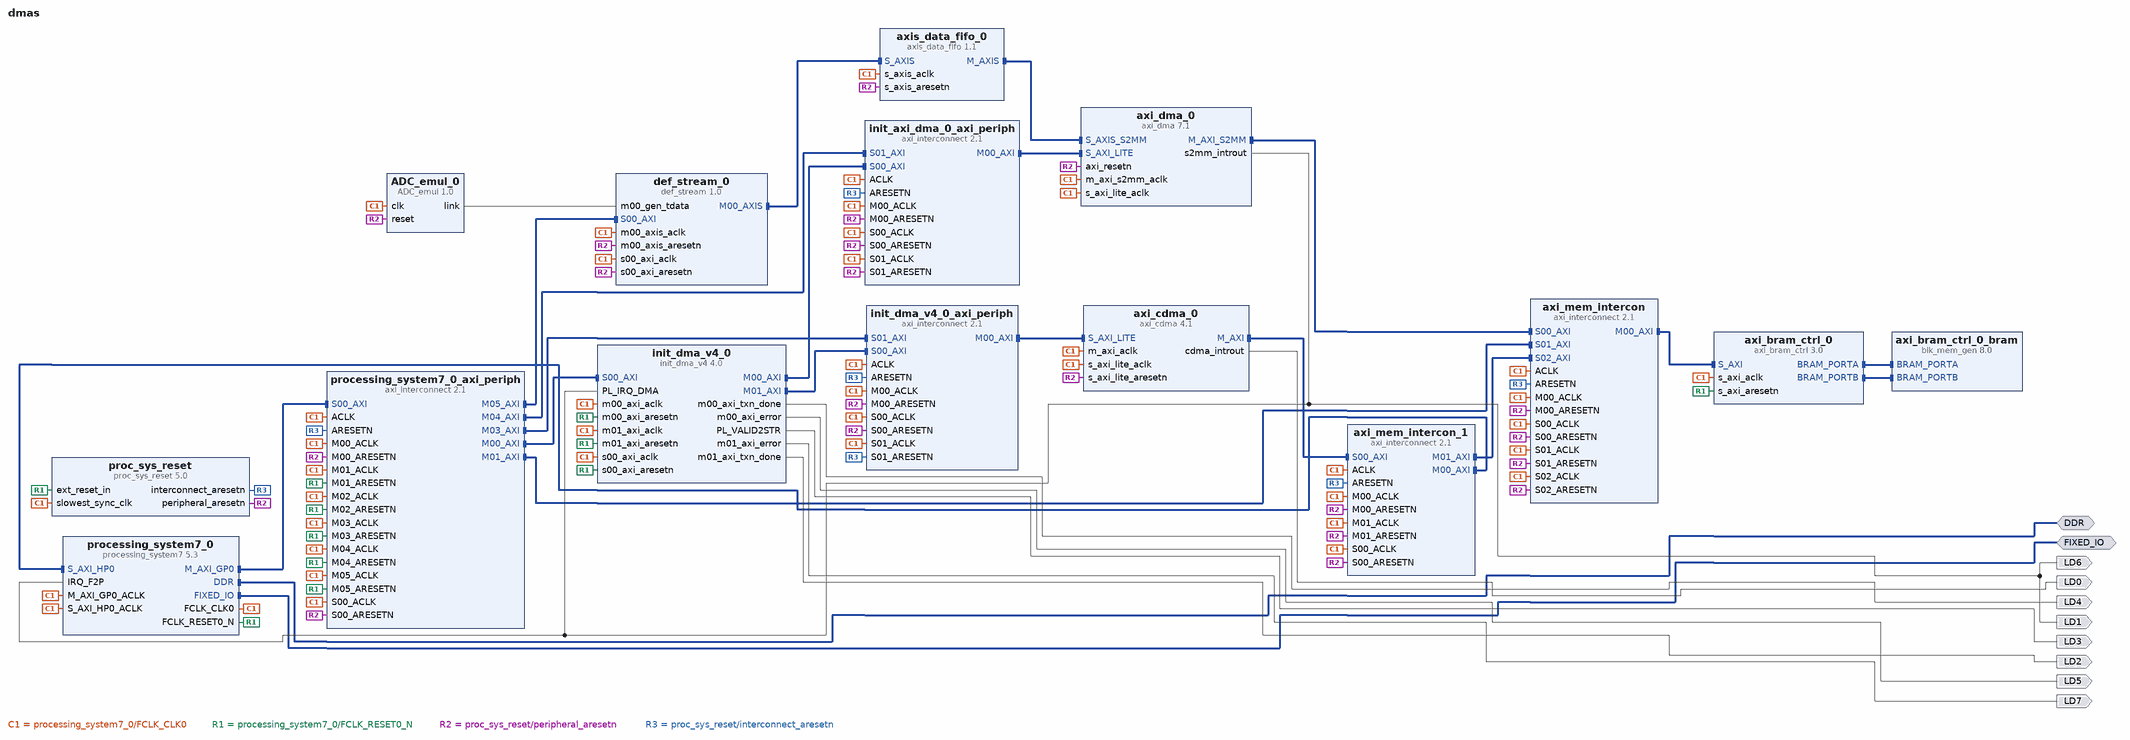
[diagram p0: block diagram of the top level]
# Vivado block design dmas, Vivado 2013.3
create_bd_design dmas

create_bd_intf_port -mode Master -vlnv xilinx.com:interface:ddrx_rtl:1.0 DDR
create_bd_intf_port -mode Master -vlnv xilinx.com:display_processing_system7:fixedio_rtl:1.0 FIXED_IO
create_bd_port -dir O LD4
create_bd_port -dir O LD5
create_bd_port -dir O LD6
create_bd_port -dir O LD1
create_bd_port -dir O LD3
create_bd_port -dir O LD0
create_bd_port -dir O LD7
create_bd_port -dir O LD2

create_bd_cell -type ip -vlnv xilinx.com:ip:processing_system7:5.3 processing_system7_0
set_property -dict [list \
  CONFIG.PCW_USE_S_AXI_HP0 1 \
  CONFIG.PCW_USE_FABRIC_INTERRUPT 1 \
  CONFIG.PCW_IRQ_F2P_INTR 1 \
  CONFIG.PCW_QSPI_GRP_FBCLK_ENABLE 1 \
  CONFIG.preset {ZedBoard*} \
] [get_bd_cells processing_system7_0]
create_bd_cell -type ip -vlnv xilinx.com:ip:axi_dma:7.1 axi_dma_0
set_property -dict [list \
  CONFIG.c_include_sg 0 \
  CONFIG.c_sg_length_width 23 \
  CONFIG.c_micro_dma 0 \
  CONFIG.c_include_mm2s 0 \
  CONFIG.c_s2mm_burst_size 16 \
] [get_bd_cells axi_dma_0]
create_bd_cell -type ip -vlnv xilinx.com:ip:axi_interconnect:2.1 axi_mem_intercon
set_property -dict {CONFIG.NUM_SI 3 CONFIG.NUM_MI 1} [get_bd_cells axi_mem_intercon]
create_bd_cell -type ip -vlnv xilinx.com:ip:proc_sys_reset:5.0 proc_sys_reset
create_bd_cell -type ip -vlnv xilinx.com:ip:axi_interconnect:2.1 processing_system7_0_axi_periph
set_property -dict {CONFIG.NUM_SI 1 CONFIG.NUM_MI 6} [get_bd_cells processing_system7_0_axi_periph]
create_bd_cell -type ip -vlnv xilinx.com:ip:axi_interconnect:2.1 init_axi_dma_0_axi_periph
set_property -dict {CONFIG.NUM_SI 2 CONFIG.NUM_MI 1} [get_bd_cells init_axi_dma_0_axi_periph]
create_bd_cell -type ip -vlnv xilinx.com:ip:axi_bram_ctrl:3.0 axi_bram_ctrl_0
create_bd_cell -type ip -vlnv xilinx.com:ip:blk_mem_gen:8.0 axi_bram_ctrl_0_bram
set_property -dict {CONFIG.Memory_Type True_Dual_Port_RAM} [get_bd_cells axi_bram_ctrl_0_bram]
create_bd_cell -type ip -vlnv xilinx.com:ip:axi_cdma:4.1 axi_cdma_0
set_property -dict {CONFIG.C_INCLUDE_SG 0} [get_bd_cells axi_cdma_0]
create_bd_cell -type ip -vlnv xilinx.com:ip:axi_interconnect:2.1 axi_mem_intercon_1
set_property -dict {CONFIG.NUM_MI 2} [get_bd_cells axi_mem_intercon_1]
create_bd_cell -type ip -vlnv xilinx.com:ip:axi_interconnect:2.1 init_dma_v4_0_axi_periph
set_property -dict {CONFIG.NUM_SI 2 CONFIG.NUM_MI 1} [get_bd_cells init_dma_v4_0_axi_periph]
create_bd_cell -type ip -vlnv xilinx.com:user:init_dma_v4:4.0 init_dma_v4_0
set_property -dict [list \
  CONFIG.C_M00_AXI_START_DATA_VALUE 0x4 \
  CONFIG.C_M00_AXI_TARGET_SLAVE_BASE_ADDR 0x41E00030 \
  CONFIG.C_M00_AXI_TRANSACTIONS_NUM 19 \
  CONFIG.C_M01_AXI_START_DATA_VALUE 0x1000 \
  CONFIG.C_M01_AXI_TARGET_SLAVE_BASE_ADDR 0x44A00000 \
  CONFIG.C_M01_AXI_TRANSACTIONS_NUM 11 \
] [get_bd_cells init_dma_v4_0]
create_bd_cell -type ip -vlnv xilinx.com:ip:axis_data_fifo:1.1 axis_data_fifo_0
set_property -dict {CONFIG.FIFO_DEPTH 32768} [get_bd_cells axis_data_fifo_0]
create_bd_cell -type ip -vlnv omega.local:user:ADC_emul:1.0 ADC_emul_0
set_property -dict {CONFIG.WIDTH 16} [get_bd_cells ADC_emul_0]
create_bd_cell -type ip -vlnv xilinx.com:user:def_stream:1.0 def_stream_0

# ---- connections ----

connect_bd_intf_net [get_bd_intf_pins processing_system7_0/M_AXI_GP0] [get_bd_intf_pins processing_system7_0_axi_periph/S00_AXI]
connect_bd_intf_net [get_bd_intf_pins axi_bram_ctrl_0_bram/BRAM_PORTA] [get_bd_intf_pins axi_bram_ctrl_0/BRAM_PORTA]
connect_bd_intf_net [get_bd_intf_pins axi_bram_ctrl_0_bram/BRAM_PORTB] [get_bd_intf_pins axi_bram_ctrl_0/BRAM_PORTB]
connect_bd_intf_net [get_bd_intf_pins processing_system7_0_axi_periph/M00_AXI] [get_bd_intf_pins init_dma_v4_0/S00_AXI]
connect_bd_intf_net [get_bd_intf_pins init_dma_v4_0/M00_AXI] [get_bd_intf_pins init_axi_dma_0_axi_periph/S00_AXI]
connect_bd_intf_net [get_bd_intf_pins axi_cdma_0/M_AXI] [get_bd_intf_pins axi_mem_intercon_1/S00_AXI]
connect_bd_intf_net [get_bd_intf_pins axi_mem_intercon_1/M00_AXI] [get_bd_intf_pins processing_system7_0/S_AXI_HP0]
connect_bd_intf_net [get_bd_intf_pins init_dma_v4_0/M01_AXI] [get_bd_intf_pins init_dma_v4_0_axi_periph/S00_AXI]
connect_bd_intf_net [get_bd_intf_pins init_dma_v4_0_axi_periph/M00_AXI] [get_bd_intf_pins axi_cdma_0/S_AXI_LITE]
connect_bd_intf_net [get_bd_intf_pins axi_mem_intercon/M00_AXI] [get_bd_intf_pins axi_bram_ctrl_0/S_AXI]
connect_bd_intf_net [get_bd_intf_pins init_axi_dma_0_axi_periph/M00_AXI] [get_bd_intf_pins axi_dma_0/S_AXI_LITE]
connect_bd_intf_net [get_bd_intf_pins axi_mem_intercon/S01_AXI] [get_bd_intf_pins processing_system7_0_axi_periph/M01_AXI]
connect_bd_intf_net [get_bd_intf_pins axi_mem_intercon/S02_AXI] [get_bd_intf_pins axi_mem_intercon_1/M01_AXI]
connect_bd_intf_net [get_bd_intf_pins init_dma_v4_0_axi_periph/S01_AXI] [get_bd_intf_pins processing_system7_0_axi_periph/M03_AXI]
connect_bd_intf_net [get_bd_intf_pins init_axi_dma_0_axi_periph/S01_AXI] [get_bd_intf_pins processing_system7_0_axi_periph/M04_AXI]
connect_bd_intf_net [get_bd_intf_pins def_stream_0/S00_AXI] [get_bd_intf_pins processing_system7_0_axi_periph/M05_AXI]
connect_bd_intf_net [get_bd_intf_pins def_stream_0/M00_AXIS] [get_bd_intf_pins axis_data_fifo_0/S_AXIS]
connect_bd_intf_net [get_bd_intf_pins axis_data_fifo_0/M_AXIS] [get_bd_intf_pins axi_dma_0/S_AXIS_S2MM]
connect_bd_intf_net [get_bd_intf_pins axi_dma_0/M_AXI_S2MM] [get_bd_intf_pins axi_mem_intercon/S00_AXI]
connect_bd_intf_net [get_bd_intf_ports DDR] [get_bd_intf_pins processing_system7_0/DDR]
connect_bd_intf_net [get_bd_intf_ports FIXED_IO] [get_bd_intf_pins processing_system7_0/FIXED_IO]
connect_bd_net [get_bd_pins processing_system7_0/FCLK_CLK0] \
  [get_bd_pins processing_system7_0/M_AXI_GP0_ACLK] [get_bd_pins processing_system7_0/S_AXI_HP0_ACLK] \
  [get_bd_pins axi_dma_0/s_axi_lite_aclk] [get_bd_pins axi_dma_0/m_axi_s2mm_aclk] [get_bd_pins axi_mem_intercon/S00_ACLK] \
  [get_bd_pins proc_sys_reset/slowest_sync_clk] [get_bd_pins axi_mem_intercon/ACLK] [get_bd_pins axi_mem_intercon/M00_ACLK] \
  [get_bd_pins processing_system7_0_axi_periph/S00_ACLK] [get_bd_pins processing_system7_0_axi_periph/ACLK] \
  [get_bd_pins processing_system7_0_axi_periph/M00_ACLK] [get_bd_pins init_axi_dma_0_axi_periph/S00_ACLK] \
  [get_bd_pins init_axi_dma_0_axi_periph/ACLK] [get_bd_pins init_axi_dma_0_axi_periph/M00_ACLK] \
  [get_bd_pins processing_system7_0_axi_periph/M01_ACLK] [get_bd_pins processing_system7_0_axi_periph/M02_ACLK] \
  [get_bd_pins axi_bram_ctrl_0/s_axi_aclk] [get_bd_pins processing_system7_0_axi_periph/M03_ACLK] \
  [get_bd_pins axi_cdma_0/m_axi_aclk] [get_bd_pins axi_mem_intercon_1/S00_ACLK] [get_bd_pins axi_mem_intercon_1/ACLK] \
  [get_bd_pins axi_mem_intercon_1/M00_ACLK] [get_bd_pins init_dma_v4_0_axi_periph/S00_ACLK] \
  [get_bd_pins init_dma_v4_0_axi_periph/ACLK] [get_bd_pins axi_cdma_0/s_axi_lite_aclk] \
  [get_bd_pins init_dma_v4_0_axi_periph/M00_ACLK] [get_bd_pins axi_mem_intercon_1/M01_ACLK] \
  [get_bd_pins axi_mem_intercon/S01_ACLK] [get_bd_pins axi_mem_intercon/S02_ACLK] \
  [get_bd_pins init_dma_v4_0_axi_periph/S01_ACLK] [get_bd_pins init_axi_dma_0_axi_periph/S01_ACLK] \
  [get_bd_pins processing_system7_0_axi_periph/M04_ACLK] [get_bd_pins processing_system7_0_axi_periph/M05_ACLK] \
  [get_bd_pins init_dma_v4_0/s00_axi_aclk] [get_bd_pins init_dma_v4_0/m00_axi_aclk] [get_bd_pins init_dma_v4_0/m01_axi_aclk] \
  [get_bd_pins axis_data_fifo_0/s_axis_aclk] [get_bd_pins ADC_emul_0/clk] [get_bd_pins def_stream_0/s00_axi_aclk] \
  [get_bd_pins def_stream_0/m00_axis_aclk]
connect_bd_net [get_bd_pins processing_system7_0/FCLK_RESET0_N] \
  [get_bd_pins proc_sys_reset/ext_reset_in] [get_bd_pins processing_system7_0_axi_periph/M01_ARESETN] \
  [get_bd_pins processing_system7_0_axi_periph/M02_ARESETN] [get_bd_pins axi_bram_ctrl_0/s_axi_aresetn] \
  [get_bd_pins processing_system7_0_axi_periph/M03_ARESETN] [get_bd_pins processing_system7_0_axi_periph/M04_ARESETN] \
  [get_bd_pins processing_system7_0_axi_periph/M05_ARESETN] [get_bd_pins init_dma_v4_0/s00_axi_aresetn] \
  [get_bd_pins init_dma_v4_0/m00_axi_aresetn] [get_bd_pins init_dma_v4_0/m01_axi_aresetn]
connect_bd_net [get_bd_pins proc_sys_reset/peripheral_aresetn] \
  [get_bd_pins axi_mem_intercon/S00_ARESETN] [get_bd_pins axi_mem_intercon/M00_ARESETN] \
  [get_bd_pins processing_system7_0_axi_periph/S00_ARESETN] [get_bd_pins processing_system7_0_axi_periph/M00_ARESETN] \
  [get_bd_pins init_axi_dma_0_axi_periph/S00_ARESETN] [get_bd_pins axi_dma_0/axi_resetn] \
  [get_bd_pins init_axi_dma_0_axi_periph/M00_ARESETN] [get_bd_pins axi_mem_intercon_1/S00_ARESETN] \
  [get_bd_pins axi_mem_intercon_1/M00_ARESETN] [get_bd_pins init_dma_v4_0_axi_periph/S00_ARESETN] \
  [get_bd_pins axi_cdma_0/s_axi_lite_aresetn] [get_bd_pins init_dma_v4_0_axi_periph/M00_ARESETN] \
  [get_bd_pins axi_mem_intercon_1/M01_ARESETN] [get_bd_pins axi_mem_intercon/S01_ARESETN] \
  [get_bd_pins axi_mem_intercon/S02_ARESETN] [get_bd_pins init_axi_dma_0_axi_periph/S01_ARESETN] \
  [get_bd_pins axis_data_fifo_0/s_axis_aresetn] [get_bd_pins ADC_emul_0/reset] [get_bd_pins def_stream_0/s00_axi_aresetn] \
  [get_bd_pins def_stream_0/m00_axis_aresetn]
connect_bd_net [get_bd_pins proc_sys_reset/interconnect_aresetn] \
  [get_bd_pins axi_mem_intercon/ARESETN] [get_bd_pins processing_system7_0_axi_periph/ARESETN] \
  [get_bd_pins init_axi_dma_0_axi_periph/ARESETN] [get_bd_pins axi_mem_intercon_1/ARESETN] \
  [get_bd_pins init_dma_v4_0_axi_periph/ARESETN] [get_bd_pins init_dma_v4_0_axi_periph/S01_ARESETN]
connect_bd_net -net init_dma_0_m00_axi_error [get_bd_pins init_dma_v4_0/m00_axi_txn_done] [get_bd_ports LD4]
connect_bd_net -net init_dma_0_m00_axi_txn_done [get_bd_pins init_dma_v4_0/m00_axi_error] [get_bd_ports LD5]
connect_bd_net [get_bd_pins axi_dma_0/s2mm_introut] \
  [get_bd_ports LD1] [get_bd_ports LD6] [get_bd_pins processing_system7_0/IRQ_F2P] [get_bd_pins init_dma_v4_0/PL_IRQ_DMA]
connect_bd_net [get_bd_pins init_dma_v4_0/PL_VALID2STR] [get_bd_ports LD3]
connect_bd_net [get_bd_pins axi_cdma_0/cdma_introut] [get_bd_ports LD0]
connect_bd_net [get_bd_pins init_dma_v4_0/m01_axi_error] [get_bd_ports LD7]
connect_bd_net [get_bd_pins init_dma_v4_0/m01_axi_txn_done] [get_bd_ports LD2]
connect_bd_net [get_bd_pins ADC_emul_0/link] [get_bd_pins def_stream_0/m00_gen_tdata]

# ---- address map ----
assign_bd_address -offset 0x00000000 -range 512M -target_address_space [get_bd_addr_spaces axi_cdma_0/Data] [get_bd_addr_segs processing_system7_0/S_AXI_HP0/HP0_DDR_LOWOCM]
assign_bd_address -offset 0x40000000 -range 256K -target_address_space [get_bd_addr_spaces axi_cdma_0/Data] [get_bd_addr_segs axi_bram_ctrl_0/S_AXI/Mem0]
assign_bd_address -offset 0x40000000 -range 256K -target_address_space [get_bd_addr_spaces axi_dma_0/Data_S2MM] [get_bd_addr_segs axi_bram_ctrl_0/S_AXI/Mem0]
assign_bd_address -offset 0x41E00000 -range 64K -target_address_space [get_bd_addr_spaces init_dma_v4_0/M00_AXI] [get_bd_addr_segs axi_dma_0/S_AXI_LITE/Reg]
assign_bd_address -offset 0x44A00000 -range 64K -target_address_space [get_bd_addr_spaces init_dma_v4_0/M01_AXI] [get_bd_addr_segs axi_cdma_0/S_AXI_LITE/Reg]
assign_bd_address -offset 0x40000000 -range 256K -target_address_space [get_bd_addr_spaces processing_system7_0/Data] [get_bd_addr_segs axi_bram_ctrl_0/S_AXI/Mem0]
assign_bd_address -offset 0x41E00000 -range 64K -target_address_space [get_bd_addr_spaces processing_system7_0/Data] [get_bd_addr_segs axi_dma_0/S_AXI_LITE/Reg]
assign_bd_address -offset 0x43C00000 -range 4K -target_address_space [get_bd_addr_spaces processing_system7_0/Data] [get_bd_addr_segs init_dma_v4_0/S00_AXI/S00_AXI_reg]
assign_bd_address -offset 0x43C02000 -range 4K -target_address_space [get_bd_addr_spaces processing_system7_0/Data] [get_bd_addr_segs def_stream_0/S00_AXI/S00_AXI_reg]
assign_bd_address -offset 0x44A00000 -range 64K -target_address_space [get_bd_addr_spaces processing_system7_0/Data] [get_bd_addr_segs axi_cdma_0/S_AXI_LITE/Reg]

validate_bd_design
save_bd_design
